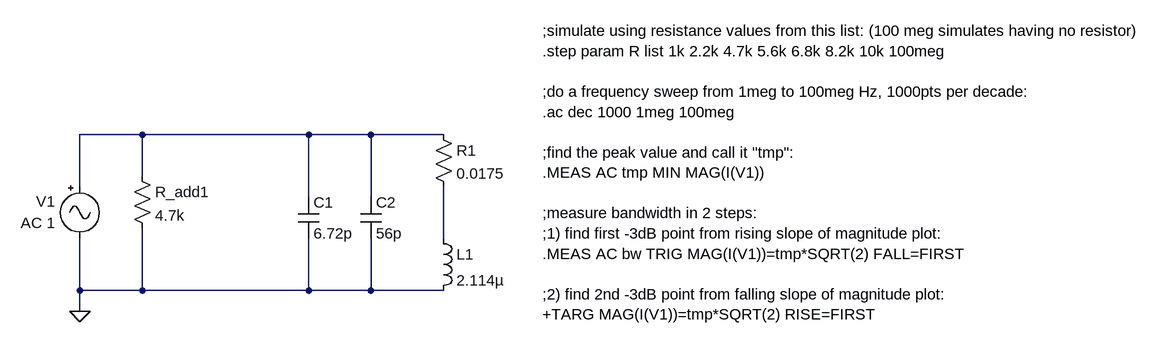
[diagram p0: schematic ant.asc]
ant.asc, the LTspice schematic file:
Version 4
SHEET 1 1932 680
WIRE 304 240 208 240
WIRE 560 240 304 240
WIRE 656 240 560 240
WIRE 768 240 656 240
WIRE 304 304 304 240
WIRE 208 320 208 240
WIRE 560 336 560 240
WIRE 656 336 656 240
WIRE 768 400 768 320
WIRE 208 480 208 400
WIRE 304 480 304 384
WIRE 304 480 208 480
WIRE 560 480 560 400
WIRE 560 480 304 480
WIRE 656 480 656 400
WIRE 656 480 560 480
WIRE 768 480 656 480
WIRE 208 512 208 480
FLAG 208 512 0
SYMBOL Misc\\signal 208 304 R0
WINDOW 0 -67 39 Left 2
WINDOW 123 -91 72 Left 2
WINDOW 39 0 0 Left 0
SYMATTR InstName V1
SYMATTR Value2 AC 1
SYMATTR Value ""
SYMBOL res 288 288 R0
SYMATTR InstName R_add1
SYMATTR Value 4.7k
SYMBOL cap 544 336 R0
SYMATTR InstName C1
SYMATTR Value 6.72p
SYMBOL res 752 224 R0
SYMATTR InstName R1
SYMATTR Value 0.0175
SYMBOL ind 752 384 R0
SYMATTR InstName L1
SYMATTR Value 2.114µ
SYMATTR SpiceLine Rser=0
SYMBOL cap 640 336 R0
SYMATTR InstName C2
SYMATTR Value 56p
TEXT 920 80 Left 2 !;simulate using resistance values from this list: (100 meg simulates having no resistor)\n.step param R list 1k 2.2k 4.7k 5.6k 6.8k 8.2k 10k 100meg\n \n;do a frequency sweep from 1meg to 100meg Hz, 1000pts per decade:\n.ac dec 1000 1meg 100meg\n \n;find the peak value and call it "tmp":\n.MEAS AC tmp MIN MAG(I(V1))\n \n;measure bandwidth in 2 steps: \n;1) find first -3dB point from rising slope of magnitude plot:\n.MEAS AC bw TRIG MAG(I(V1))=tmp*SQRT(2) FALL=FIRST\n \n;2) find 2nd -3dB point from falling slope of magnitude plot:\n+TARG MAG(I(V1))=tmp*SQRT(2) RISE=FIRST

The netlist it stands for:
* ant.asc
V1 N001 0 AC 1
R_add1 N001 0 4.7k
C1 N001 0 6.72p
R1 N001 N002 0.0175
L1 N002 0 2.114µ Rser=0
C2 N001 0 56p
;simulate using resistance values from this list: (100 meg simulates having no resistor)
.step param R list 1k 2.2k 4.7k 5.6k 6.8k 8.2k 10k 100meg
;do a frequency sweep from 1meg to 100meg Hz, 1000pts per decade:
.ac dec 1000 1meg 100meg
;find the peak value and call it "tmp":
.MEAS AC tmp MIN MAG(I(V1))
;measure bandwidth in 2 steps:
;1) find first -3dB point from rising slope of magnitude plot:
.MEAS AC bw TRIG MAG(I(V1))=tmp*SQRT(2) FALL=FIRST
;2) find 2nd -3dB point from falling slope of magnitude plot:
+TARG MAG(I(V1))=tmp*SQRT(2) RISE=FIRST
.backanno
.end

* Results of the author's LTspice run, read from the files saved beside the schematic
* From the log:
*   Measurement: tmp
*     step  MIN(mag(i(v1)))  FROM  TO
*        1  (-73.4095dB,0°)  1e+006  1e+008
*        2  (-73.4095dB,0°)  1e+006  1e+008
*        3  (-73.4095dB,0°)  1e+006  1e+008
*        4  (-73.4095dB,0°)  1e+006  1e+008
*        5  (-73.4095dB,0°)  1e+006  1e+008
*        6  (-73.4095dB,0°)  1e+006  1e+008
*        7  (-73.4095dB,0°)  1e+006  1e+008
*        8  (-73.4095dB,0°)  1e+006  1e+008
*   Measurement: bw
*     step  bw  FROM  TO
*        1  542523  1.35532e+007  1.40957e+007
*        2  542523  1.35532e+007  1.40957e+007
*        3  542523  1.35532e+007  1.40957e+007
*        4  542523  1.35532e+007  1.40957e+007
*        5  542523  1.35532e+007  1.40957e+007
*        6  542523  1.35532e+007  1.40957e+007
*        7  542523  1.35532e+007  1.40957e+007
*        8  542523  1.35532e+007  1.40957e+007